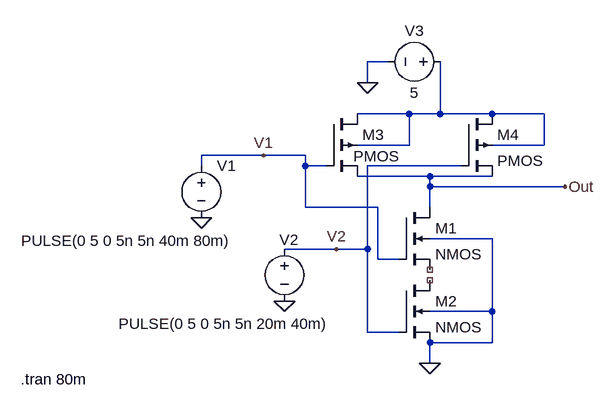
[diagram p0: schematic CMOS NAND.asc]
CMOS NAND.asc, the LTspice schematic file:
Version 4
SHEET 1 880 680
WIRE 160 -160 128 -160
WIRE 128 -128 128 -160
WIRE 192 -80 112 -80
WIRE 240 -80 240 -160
WIRE 240 -80 192 -80
WIRE 320 -80 240 -80
WIRE 400 -80 320 -80
WIRE 192 -32 192 -80
WIRE 192 -32 112 -32
WIRE 400 -32 400 -80
WIRE 400 -32 320 -32
WIRE -32 -16 -128 -16
WIRE 32 -16 -32 -16
WIRE -128 0 -128 -16
WIRE 32 0 32 -16
WIRE 64 0 32 0
WIRE 272 0 128 0
WIRE 224 16 112 16
WIRE 320 16 224 16
WIRE 224 32 224 16
WIRE 432 32 224 32
WIRE 32 64 32 0
WIRE 144 64 32 64
WIRE 224 64 224 32
WIRE 320 112 224 112
WIRE 80 128 0 128
WIRE 128 128 128 0
WIRE 128 128 80 128
WIRE 144 144 144 64
WIRE 176 144 144 144
WIRE 320 224 320 112
WIRE 320 224 224 224
WIRE 128 256 128 128
WIRE 176 256 128 256
WIRE 320 272 320 224
WIRE 320 272 224 272
WIRE 224 304 224 272
FLAG 0 208 0
FLAG -128 80 0
FLAG 224 304 0
FLAG 128 -128 0
FLAG 432 32 Out
FLAG -32 -16 V1
FLAG 80 128 V2
SYMBOL nmos4 176 64 R0
SYMATTR InstName M1
SYMBOL nmos4 176 176 R0
SYMATTR InstName M2
SYMBOL pmos4 64 -80 R0
WINDOW 3 42 65 Left 2
SYMATTR InstName M3
SYMBOL pmos4 272 -80 R0
SYMATTR InstName M4
SYMBOL voltage -128 -16 R0
WINDOW 3 -277 131 Left 2
WINDOW 123 0 0 Left 0
WINDOW 39 0 0 Left 0
SYMATTR InstName V1
SYMATTR Value PULSE(0 5 0 5n 5n 40m 80m)
SYMBOL voltage 0 112 R0
WINDOW 0 -8 2 Left 2
WINDOW 3 -255 131 Left 2
WINDOW 123 0 0 Left 0
WINDOW 39 0 0 Left 0
SYMATTR InstName V2
SYMATTR Value PULSE(0 5 0 5n 5n 20m 40m)
SYMBOL voltage 256 -160 R90
WINDOW 0 -32 56 VBottom 2
WINDOW 3 32 56 VTop 2
WINDOW 123 0 0 Left 0
WINDOW 39 0 0 Left 0
SYMATTR InstName V3
SYMATTR Value 5
TEXT -406 328 Left 2 !.tran 80m

The netlist it stands for:
* CMOS NAND.asc
M1 Out V1 NC_01 0 NMOS
M2 NC_02 V2 0 0 NMOS
M3 N001 V1 Out N001 PMOS
M4 N001 V2 Out N001 PMOS
V1 V1 0 PULSE(0 5 0 5n 5n 40m 80m)
V2 V2 0 PULSE(0 5 0 5n 5n 20m 40m)
V3 N001 0 5
.model NMOS NMOS
.model PMOS PMOS
.lib standard.mos
.tran 80m
.backanno
.end